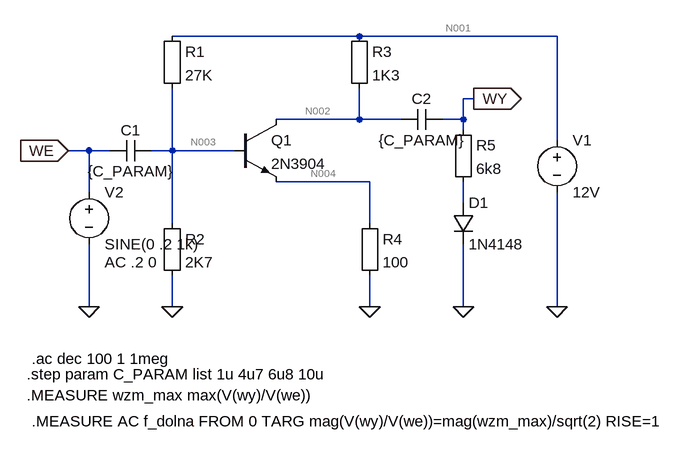
[diagram p0: schematic v4.asc]
v4.asc, the LTspice schematic file:
Version 4.1
SHEET 1 1012 680
WIRE 464 32 176 32
WIRE 768 32 464 32
WIRE 640 128 624 128
WIRE 464 160 464 112
WIRE 464 160 336 160
WIRE 528 160 464 160
WIRE 624 160 624 128
WIRE 624 160 592 160
WIRE 624 176 624 160
WIRE 768 192 768 32
WIRE 48 208 16 208
WIRE 80 208 48 208
WIRE 176 208 176 112
WIRE 176 208 144 208
WIRE 272 208 176 208
WIRE 480 256 336 256
WIRE 48 272 48 208
WIRE 624 288 624 256
WIRE 176 320 176 208
WIRE 480 320 480 256
WIRE 48 448 48 352
WIRE 176 448 176 400
WIRE 480 448 480 400
WIRE 624 448 624 352
WIRE 768 448 768 272
FLAG 176 448 0
FLAG 480 448 0
FLAG 768 448 0
FLAG 16 208 WE
IOPIN 16 208 In
FLAG 640 128 WY
IOPIN 640 128 Out
FLAG 624 448 0
FLAG 48 448 0
DATAFLAG 224 208 "$-V(N002)"
SYMBOL npn 272 160 R0
SYMATTR InstName Q1
SYMATTR Value 2N3904
SYMBOL Misc\\EuropeanResistor 160 16 R0
SYMATTR InstName R1
SYMATTR Value 27K
SYMBOL Misc\\EuropeanResistor 160 304 R0
SYMATTR InstName R2
SYMATTR Value 2K7
SYMBOL Misc\\EuropeanResistor 448 16 R0
SYMATTR InstName R3
SYMATTR Value 1K3
SYMBOL Misc\\EuropeanResistor 464 304 R0
SYMATTR InstName R4
SYMATTR Value 100
SYMBOL voltage 768 176 R0
WINDOW 123 0 0 Left 0
WINDOW 39 0 0 Left 0
SYMATTR InstName V1
SYMATTR Value 12V
SYMBOL Misc\\EuropeanResistor 608 160 R0
SYMATTR InstName R5
SYMATTR Value 6k8
SYMBOL diode 608 288 R0
SYMATTR InstName D1
SYMATTR Value 1N4148
SYMBOL voltage 48 256 R0
WINDOW 123 24 124 Left 2
WINDOW 39 0 0 Left 0
SYMATTR Value2 AC .2 0
SYMATTR InstName V2
SYMATTR Value SINE(0 .2 1k)
SYMBOL cap 144 192 R90
WINDOW 0 0 32 VBottom 2
WINDOW 3 32 32 VTop 2
SYMATTR InstName C1
SYMATTR Value {C_PARAM}
SYMBOL cap 592 144 R90
WINDOW 0 0 32 VBottom 2
WINDOW 3 32 32 VTop 2
SYMATTR InstName C2
SYMATTR Value {C_PARAM}
TEXT -48 552 Left 2 !.step param C_PARAM list 1u 4u7 6u8 10u
TEXT -40 528 Left 2 !.ac dec 100 1 1meg
TEXT -48 584 Left 2 !.MEASURE wzm_max max(V(wy)/V(we))
TEXT -40 624 Left 2 !.MEASURE AC f_dolna FROM 0 TARG mag(V(wy)/V(we))=mag(wzm_max)/sqrt(2) RISE=1

The netlist it stands for:
* v4.asc
Q1 N002 N003 N004 0 2N3904
R1 N001 N003 27K
R2 N003 0 2K7
R3 N001 N002 1K3
R4 N004 0 100
V1 N001 0 12V
R5 WY N005 6k8
D1 N005 0 1N4148
V2 WE 0 SINE(0 .2 1k) AC .2 0
C1 N003 WE {C_PARAM}
C2 WY N002 {C_PARAM}
.model D D
.lib standard.dio
.model NPN NPN
.model PNP PNP
.lib standard.bjt
.step param C_PARAM list 1u 4u7 6u8 10u
.ac dec 100 1 1meg
.MEASURE wzm_max max(V(wy)/V(we))
.MEASURE AC f_dolna FROM 0 TARG mag(V(wy)/V(we))=mag(wzm_max)/sqrt(2) RISE=1
.backanno
.end

* Results of the author's LTspice run, read from the files saved beside the schematic
* Operating Point (first step), zero values left out:
*   V(n001) = 12 V
*   V(n002) = 7.16 V
*   V(n003) = 1.062 V
*   V(n004) = 373.5 mV
*   I(R1) = 405.1 µA
*   I(R2) = 393.3 µA
*   I(R3) = 3.723 mA
*   I(R4) = 3.735 mA
*   I(V1) = -4.128 mA
*   Ib(Q1) = 11.8 µA
*   Ic(Q1) = 3.723 mA
*   Ie(Q1) = -3.735 mA
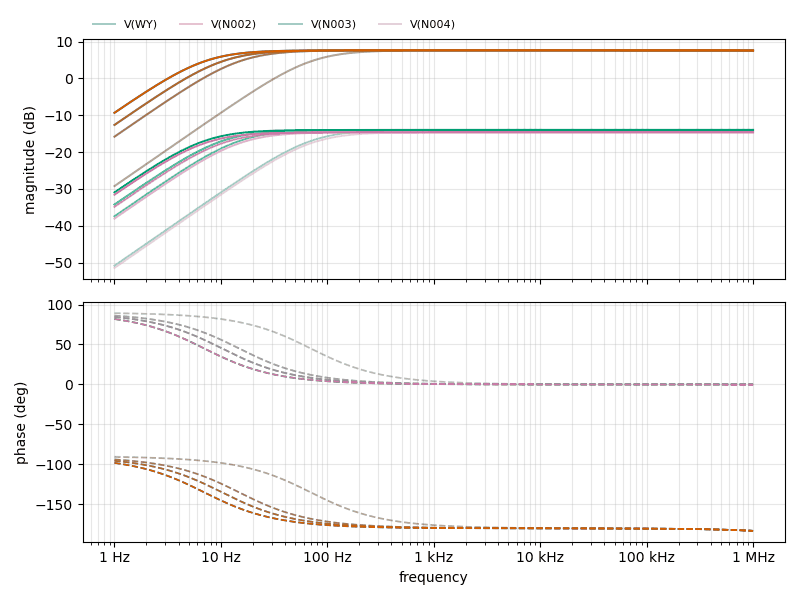
[diagram p1: AC Analysis of v4.asc, plotted from the saved traces]
* AC Analysis, 4 runs:
*   V(WY) [c_param=1e-06]: -29.24 dB at 1 Hz, 7.58 dB at 1 MHz, peak 7.64 dB at 24.55 kHz, 3 dB below the peak at 69.79 Hz
*   V(WY) [c_param=4.7e-06]: -15.81 dB at 1 Hz, 7.58 dB at 1 MHz, peak 7.64 dB at 11.22 kHz, 3 dB below the peak at 14.85 Hz
*   V(WY) [c_param=6.8e-06]: -12.62 dB at 1 Hz, 7.58 dB at 1 MHz, peak 7.64 dB at 9.333 kHz, 3 dB below the peak at 10.26 Hz
*   V(WY) [c_param=1e-05]: -9.32 dB at 1 Hz, 7.58 dB at 1 MHz, peak 7.64 dB at 7.762 kHz, 3 dB below the peak at 6.98 Hz
*   V(N002) [c_param=1e-06]: -29.23 dB at 1 Hz, 7.58 dB at 1 MHz, peak 7.64 dB at 24.55 kHz, 3 dB below the peak at 69.79 Hz
*   V(N002) [c_param=4.7e-06]: -15.81 dB at 1 Hz, 7.58 dB at 1 MHz, peak 7.64 dB at 11.22 kHz, 3 dB below the peak at 14.85 Hz
*   V(N002) [c_param=6.8e-06]: -12.62 dB at 1 Hz, 7.58 dB at 1 MHz, peak 7.64 dB at 9.333 kHz, 3 dB below the peak at 10.26 Hz
*   V(N002) [c_param=1e-05]: -9.32 dB at 1 Hz, 7.58 dB at 1 MHz, peak 7.64 dB at 7.762 kHz, 3 dB below the peak at 6.98 Hz
*   V(N003) [c_param=1e-06]: -50.86 dB at 1 Hz, -13.98 dB at 1 MHz, peak -13.98 dB at 1 MHz, 3 dB below the peak at 69.79 Hz
*   V(N003) [c_param=4.7e-06]: -37.43 dB at 1 Hz, -13.98 dB at 1 MHz, peak -13.98 dB at 1 MHz, 3 dB below the peak at 14.85 Hz
*   V(N003) [c_param=6.8e-06]: -34.25 dB at 1 Hz, -13.98 dB at 1 MHz, peak -13.98 dB at 1 MHz, 3 dB below the peak at 10.26 Hz
*   V(N003) [c_param=1e-05]: -30.94 dB at 1 Hz, -13.98 dB at 1 MHz, peak -13.98 dB at 1 MHz, 3 dB below the peak at 6.98 Hz
*   V(N004) [c_param=1e-06]: -51.48 dB at 1 Hz, -14.61 dB at 1 MHz, peak -14.61 dB at 64.57 kHz, 3 dB below the peak at 69.79 Hz
*   V(N004) [c_param=4.7e-06]: -38.06 dB at 1 Hz, -14.61 dB at 1 MHz, peak -14.61 dB at 30.2 kHz, 3 dB below the peak at 14.85 Hz
*   V(N004) [c_param=6.8e-06]: -34.87 dB at 1 Hz, -14.61 dB at 1 MHz, peak -14.61 dB at 25.12 kHz, 3 dB below the peak at 10.26 Hz
*   V(N004) [c_param=1e-05]: -31.57 dB at 1 Hz, -14.61 dB at 1 MHz, peak -14.61 dB at 20.42 kHz, 3 dB below the peak at 6.98 Hz
* From the log:
*   Measurement: wzm_max
*     step  MAX(V(wy)/V(we))  FROM  TO
*        1  (21.6209809018dB,-179.915593461°)  1  1000000
*        2  (21.6212642083dB,-179.960050978°)  1  1000000
*        3  (21.6212878548dB,-179.966831495°)  1  1000000
*        4  (21.6213047896dB,-179.973307994°)  1  1000000
*   Measurement: f_dolna
*     step  f_dolna  FROM  TO
*        1  69.7969410305  0  69.7969410305
*        2  14.8502122664  0  14.8502122664
*        3  10.2639905269  0  10.2639905269
*        4  6.97998226072  0  6.97998226072